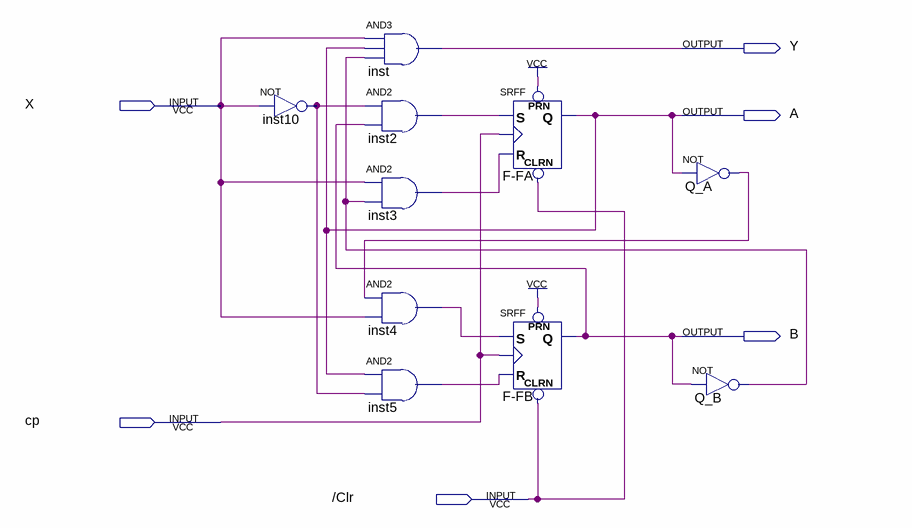
[diagram p0: schematic sheet]
// Quartus schematic Seq_Ex.bdf as structural Verilog: 10 symbols, 6 pins
module Seq_Ex (
  input  X,
  input  cp,
  input  \/Clr ,
  output Y,
  output A,
  output B
);

  wire inst2_out, inst3_out, inst4_out, inst5_out, inst10_out, Q_A_out, Q_B_out;

  not inst10 (inst10_out, X);
  and inst (Y, X, A, Q_B_out);
  and inst2 (inst2_out, inst10_out, B);
  and inst3 (inst3_out, X, Q_B_out);
  and inst4 (inst4_out, Q_A_out, X);
  and inst5 (inst5_out, A, inst10_out);
  SRFF \F-FA  (.PRN(1'b1), .CLRN(\/Clr ), .S(inst2_out), .R(inst3_out), .CLK(cp), .Q(A));
  SRFF \F-FB  (.PRN(1'b1), .CLRN(\/Clr ), .S(inst4_out), .R(inst5_out), .CLK(cp), .Q(B));
  not Q_A (Q_A_out, A);
  not Q_B (Q_B_out, B);
endmodule
